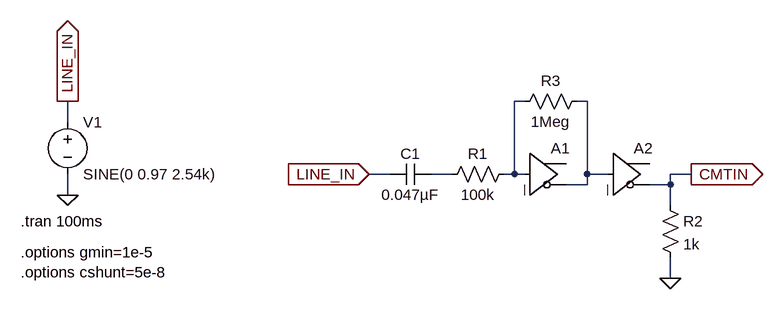
[diagram p0: schematic cd150-line-in.asc]
cd150-line-in.asc, the LTspice schematic file:
Version 4
SHEET 1 880 680
WIRE 320 -320 304 -320
WIRE 416 -320 400 -320
WIRE -384 -288 -384 -320
WIRE 112 -208 80 -208
WIRE 208 -208 176 -208
WIRE 304 -208 304 -320
WIRE 304 -208 288 -208
WIRE 320 -208 304 -208
WIRE 416 -208 416 -320
WIRE 448 -208 416 -208
WIRE 576 -208 544 -208
WIRE 416 -192 416 -208
WIRE 416 -192 384 -192
WIRE 544 -192 544 -208
WIRE 544 -192 512 -192
WIRE -384 -176 -384 -208
WIRE 544 -160 544 -192
WIRE 544 -48 544 -80
FLAG 576 -208 CMTIN
IOPIN 576 -208 Out
FLAG 80 -208 LINE_IN
IOPIN 80 -208 In
FLAG -384 -176 0
FLAG -384 -320 LINE_IN
IOPIN -384 -320 Out
FLAG 544 -48 0
SYMBOL cap 176 -224 R90
WINDOW 0 0 32 VBottom 2
WINDOW 3 32 32 VTop 2
SYMATTR InstName C1
SYMATTR Value 0.047µF
SYMBOL res 304 -224 R90
WINDOW 0 0 56 VBottom 2
WINDOW 3 32 56 VTop 2
SYMATTR InstName R1
SYMATTR Value 100k
SYMBOL voltage -384 -304 R0
WINDOW 123 24 44 Left 2
WINDOW 39 0 0 Left 0
SYMATTR InstName V1
SYMATTR Value SINE(0 0.97 2.54k)
SYMBOL Digital\\buf 320 -272 R0
SYMATTR InstName A1
SYMATTR Value2 Vhigh=5 Vlow=0 Ref=1.5
SYMBOL Digital\\buf 448 -272 R0
SYMATTR InstName A2
SYMATTR Value2 Vhigh=5 Vlow=0 Ref=1.5
SYMBOL res 528 -176 R0
SYMATTR InstName R2
SYMATTR Value 1k
SYMBOL res 416 -336 R90
WINDOW 0 0 56 VBottom 2
WINDOW 3 32 56 VTop 2
SYMATTR InstName R3
SYMATTR Value 1Meg
TEXT -456 -136 Left 2 !.tran 100ms
TEXT -456 -88 Left 2 !.options gmin=1e-5\n.options cshunt=5e-8

The netlist it stands for:
* cd150-line-in.asc
C1 N003 LINE_IN 0.047µF
R1 N001 N003 100k
V1 LINE_IN 0 SINE(0 0.97 2.54k)
A1 N001 0 0 0 0 N002 0 0 BUF Vhigh=5 Vlow=0 Ref=1.5
A2 N002 0 0 0 0 CMTIN 0 0 BUF Vhigh=5 Vlow=0 Ref=1.5
R2 CMTIN 0 1k
R3 N002 N001 1Meg
.tran 100ms
.options gmin=1e-5
.options cshunt=5e-8
.backanno
.end